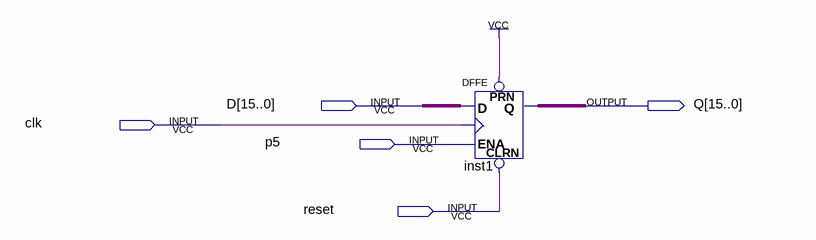
[diagram p0: schematic sheet]
// Quartus schematic pc2.bdf as structural Verilog: 1 symbols, 5 pins
module pc2 (
  input  [15:0] D,
  input  clk,
  input  p5,
  input  reset,
  output [15:0] Q
);

  DFFE inst1[15:0] (.PRN(1'b1), .CLRN(reset), .D(D), .CLK(clk), .ENA(p5), .Q(Q));
endmodule
